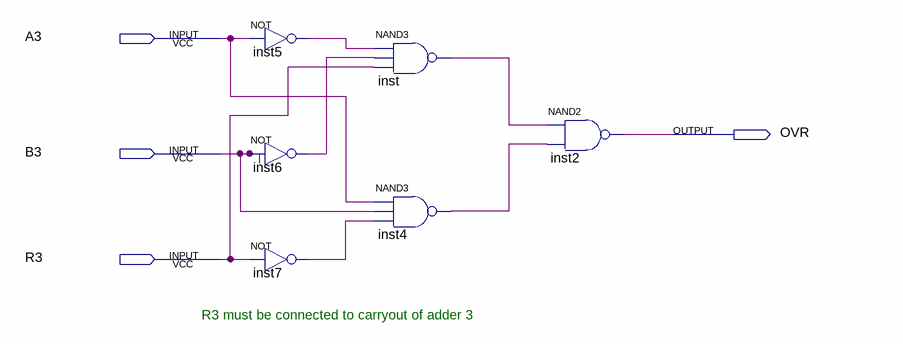
[diagram p0: schematic sheet]
// Quartus schematic overflowDetect.bdf as structural Verilog: 6 symbols, 4 pins
module overflowDetect (
  input  A3,
  input  B3,
  input  R3,
  output OVR
);

  wire inst4_out, inst5_out, inst6_out, inst7_out, inst_out;

  not inst5 (inst5_out, A3);
  not inst6 (inst6_out, B3);
  not inst7 (inst7_out, R3);
  nand inst (inst_out, inst5_out, inst6_out, R3);
  nand inst4 (inst4_out, A3, B3, inst7_out);
  nand inst2 (OVR, inst_out, inst4_out);

  // Notes on the sheet:
  //   R3 must be connected to carryout of adder 3
endmodule
